# Altium schematic sheet CW308_K82_UFO.SchDoc: CW308 Connections
size Letter; Organization: NewAE Technology Inc.; Address1: 1083 Queen St., Suite 196; Address2: Halifax; Address3: NS; Address4: Canada B3H 0B2; SheetApproved: NO
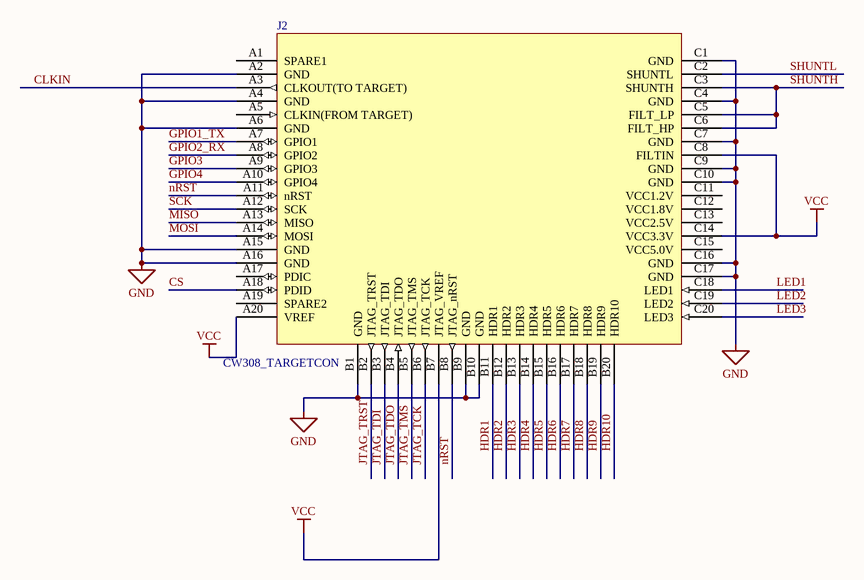
[diagram p0: CW308_K82_UFO.SchDoc]

## Parts
J2  CW308_TARGETCON  [CW308_TBOARD_CONN]

## Nets
GND: J2.A2(GND) J2.A4(GND) J2.A6(GND) J2.A15(GND) J2.A16(GND) J2.B1(GND) J2.B9(GND) J2.B10(GND) J2.C1(GND) J2.C4(GND) J2.C7(GND) J2.C9(GND) J2.C10(GND) J2.C16(GND) J2.C17(GND)
VCC: J2.A20(VREF) J2.B7(JTAG_VREF) J2.C8(FILTIN) J2.C14(VCC3.3V)
CLKIN: J2.A3(CLKOUT(TO_TARGET))
CS: J2.A18(PDID)
GPIO1_TX: J2.A7(GPIO1)
GPIO2_RX: J2.A8(GPIO2)
GPIO3: J2.A9(GPIO3)
GPIO4: J2.A10(GPIO4)
HDR1: J2.B11(HDR1)
HDR2: J2.B12(HDR2)
HDR3: J2.B13(HDR3)
HDR4: J2.B14(HDR4)
HDR5: J2.B15(HDR5)
HDR6: J2.B16(HDR6)
HDR7: J2.B17(HDR7)
HDR8: J2.B18(HDR8)
HDR9: J2.B19(HDR9)
HDR10: J2.B20(HDR10)
JTAG_TCK: J2.B6(JTAG_TCK)
JTAG_TDI: J2.B3(JTAG_TDI)
JTAG_TDO: J2.B4(JTAG_TDO)
JTAG_TMS: J2.B5(JTAG_TMS)
JTAG_TRST: J2.B2(JTAG_TRST)
LED1: J2.C18(LED1)
LED2: J2.C19(LED2)
LED3: J2.C20(LED3)
MISO: J2.A13(MISO)
MOSI: J2.A14(MOSI)
nRST: J2.A11(nRST) J2.B8(JTAG_nRST)
SCK: J2.A12(SCK)
SHUNTH: J2.C3(SHUNTH) J2.C5(FILT_LP) J2.C6(FILT_HP)
SHUNTL: J2.C2(SHUNTL)

Not connected (* = marked no-connect by the designer): J2 A1(SPARE1) A5(CLKIN(FROM_TARGET)) A17(PDIC) A19(SPARE2) C11(VCC1.2V) C12(VCC1.8V) C13(VCC2.5V) C15(VCC5.0V)

## Notes on the sheet
- Title:
- Date:
- Rev:
- Time:
- Project:
- Sheet
- of
- License:
- Copyright © NewAE Technology Inc.
- Approved:
- NewAE.com
- File:

## Library data of the parts
J2 = CW308_TBOARD: CW308 "Standard" Target Board Connector; Component Group: Mechanical; Pitch: 2.54mm; Part Number: CW308_TBOARD; Pin Count: 60; Mounting Technology: Through-hole; Component Kind: Standard; Component Type: Standard